# EAGLE design Reach_A0 (EAGLE 6.5.0)
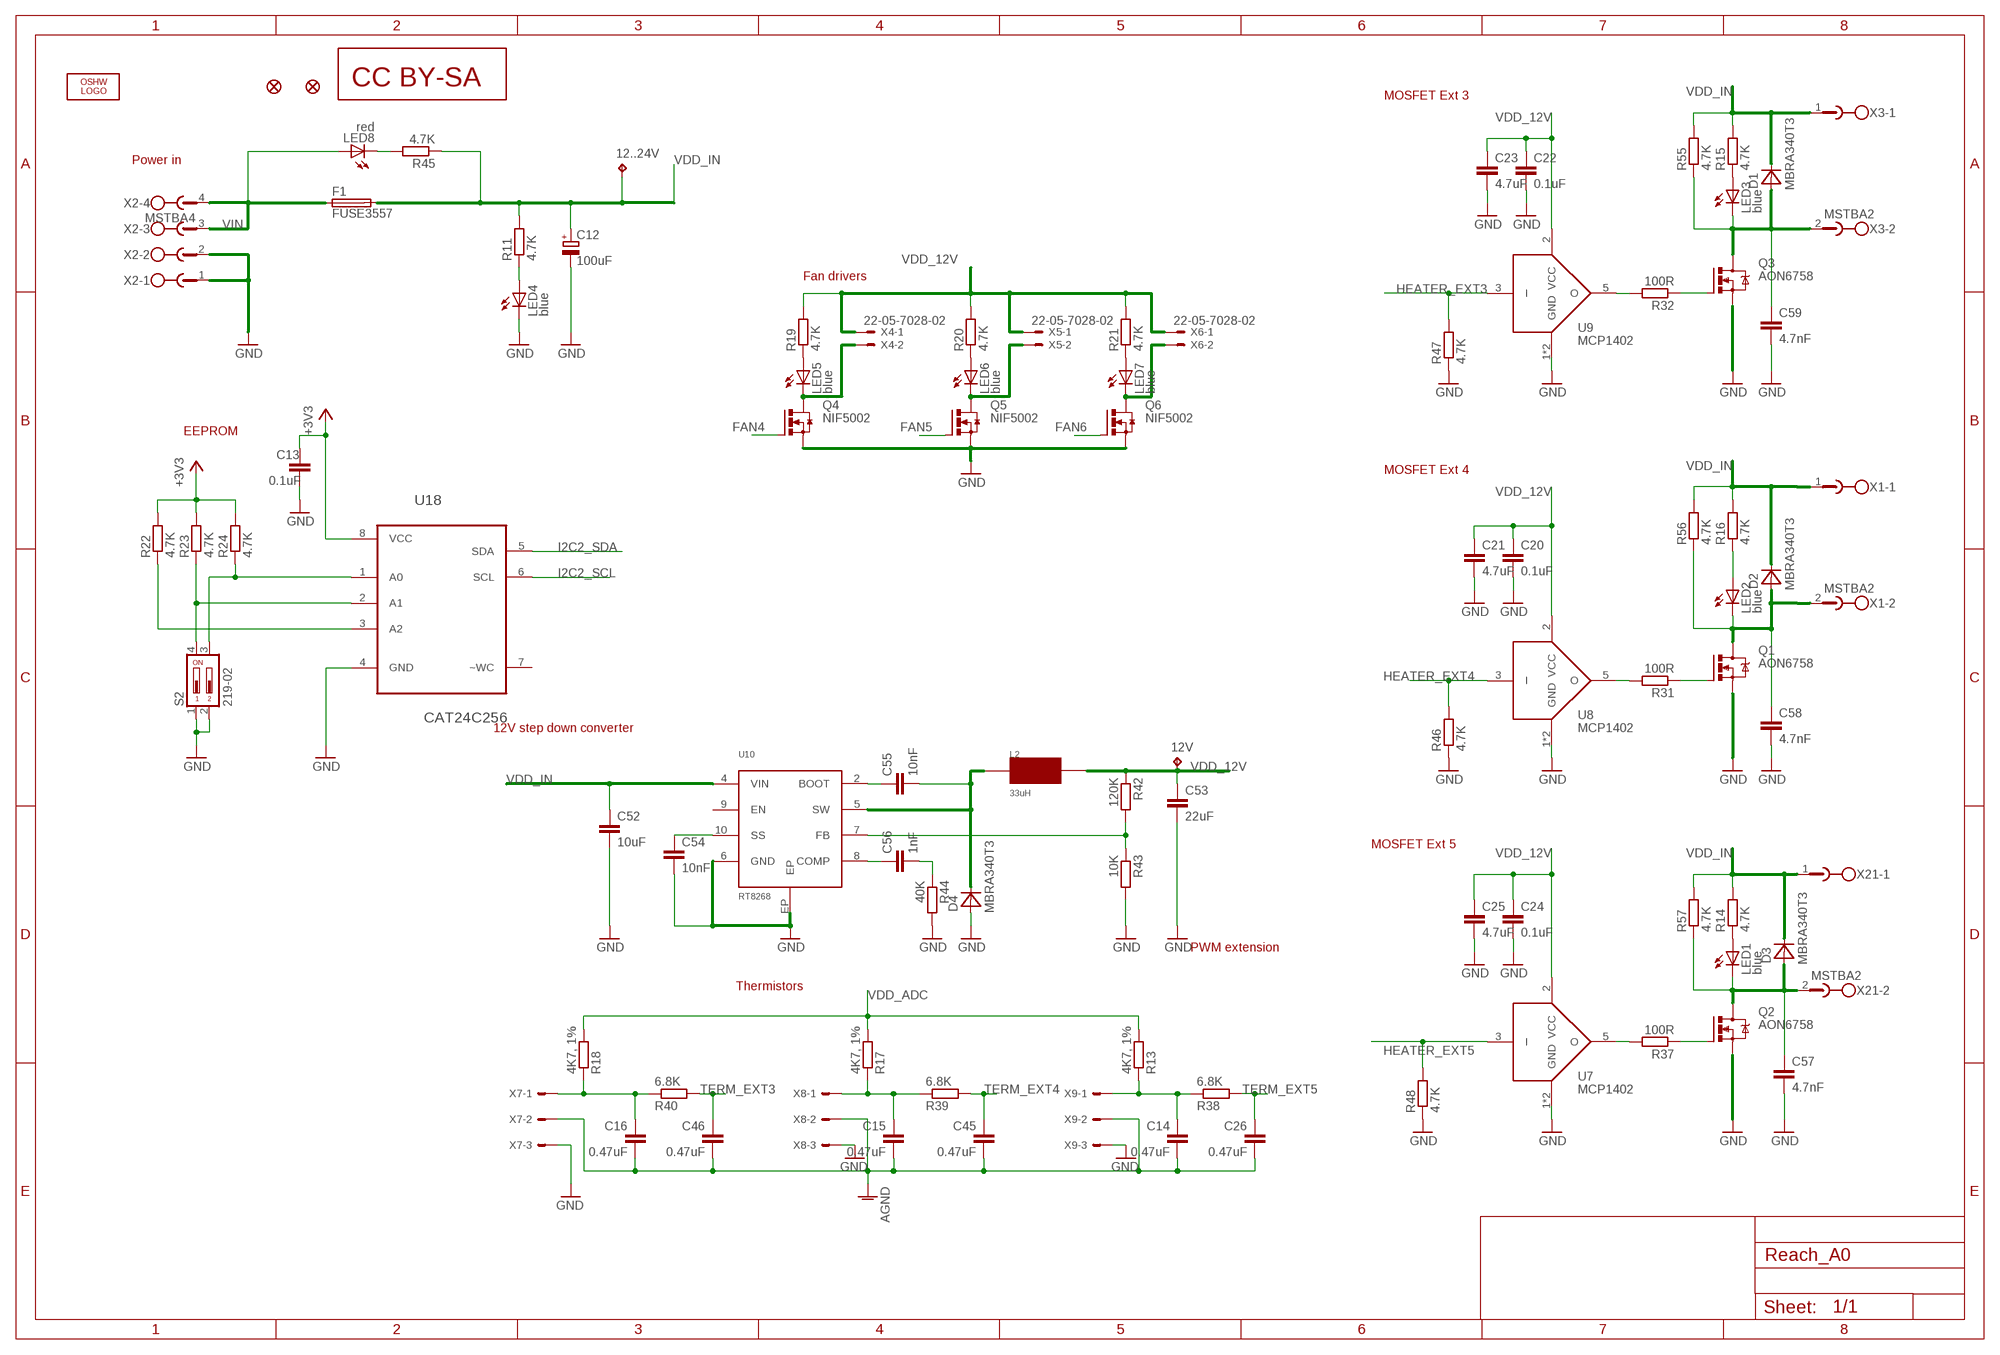
[diagram p0: schematic, sheet 1, part 1 of 2]
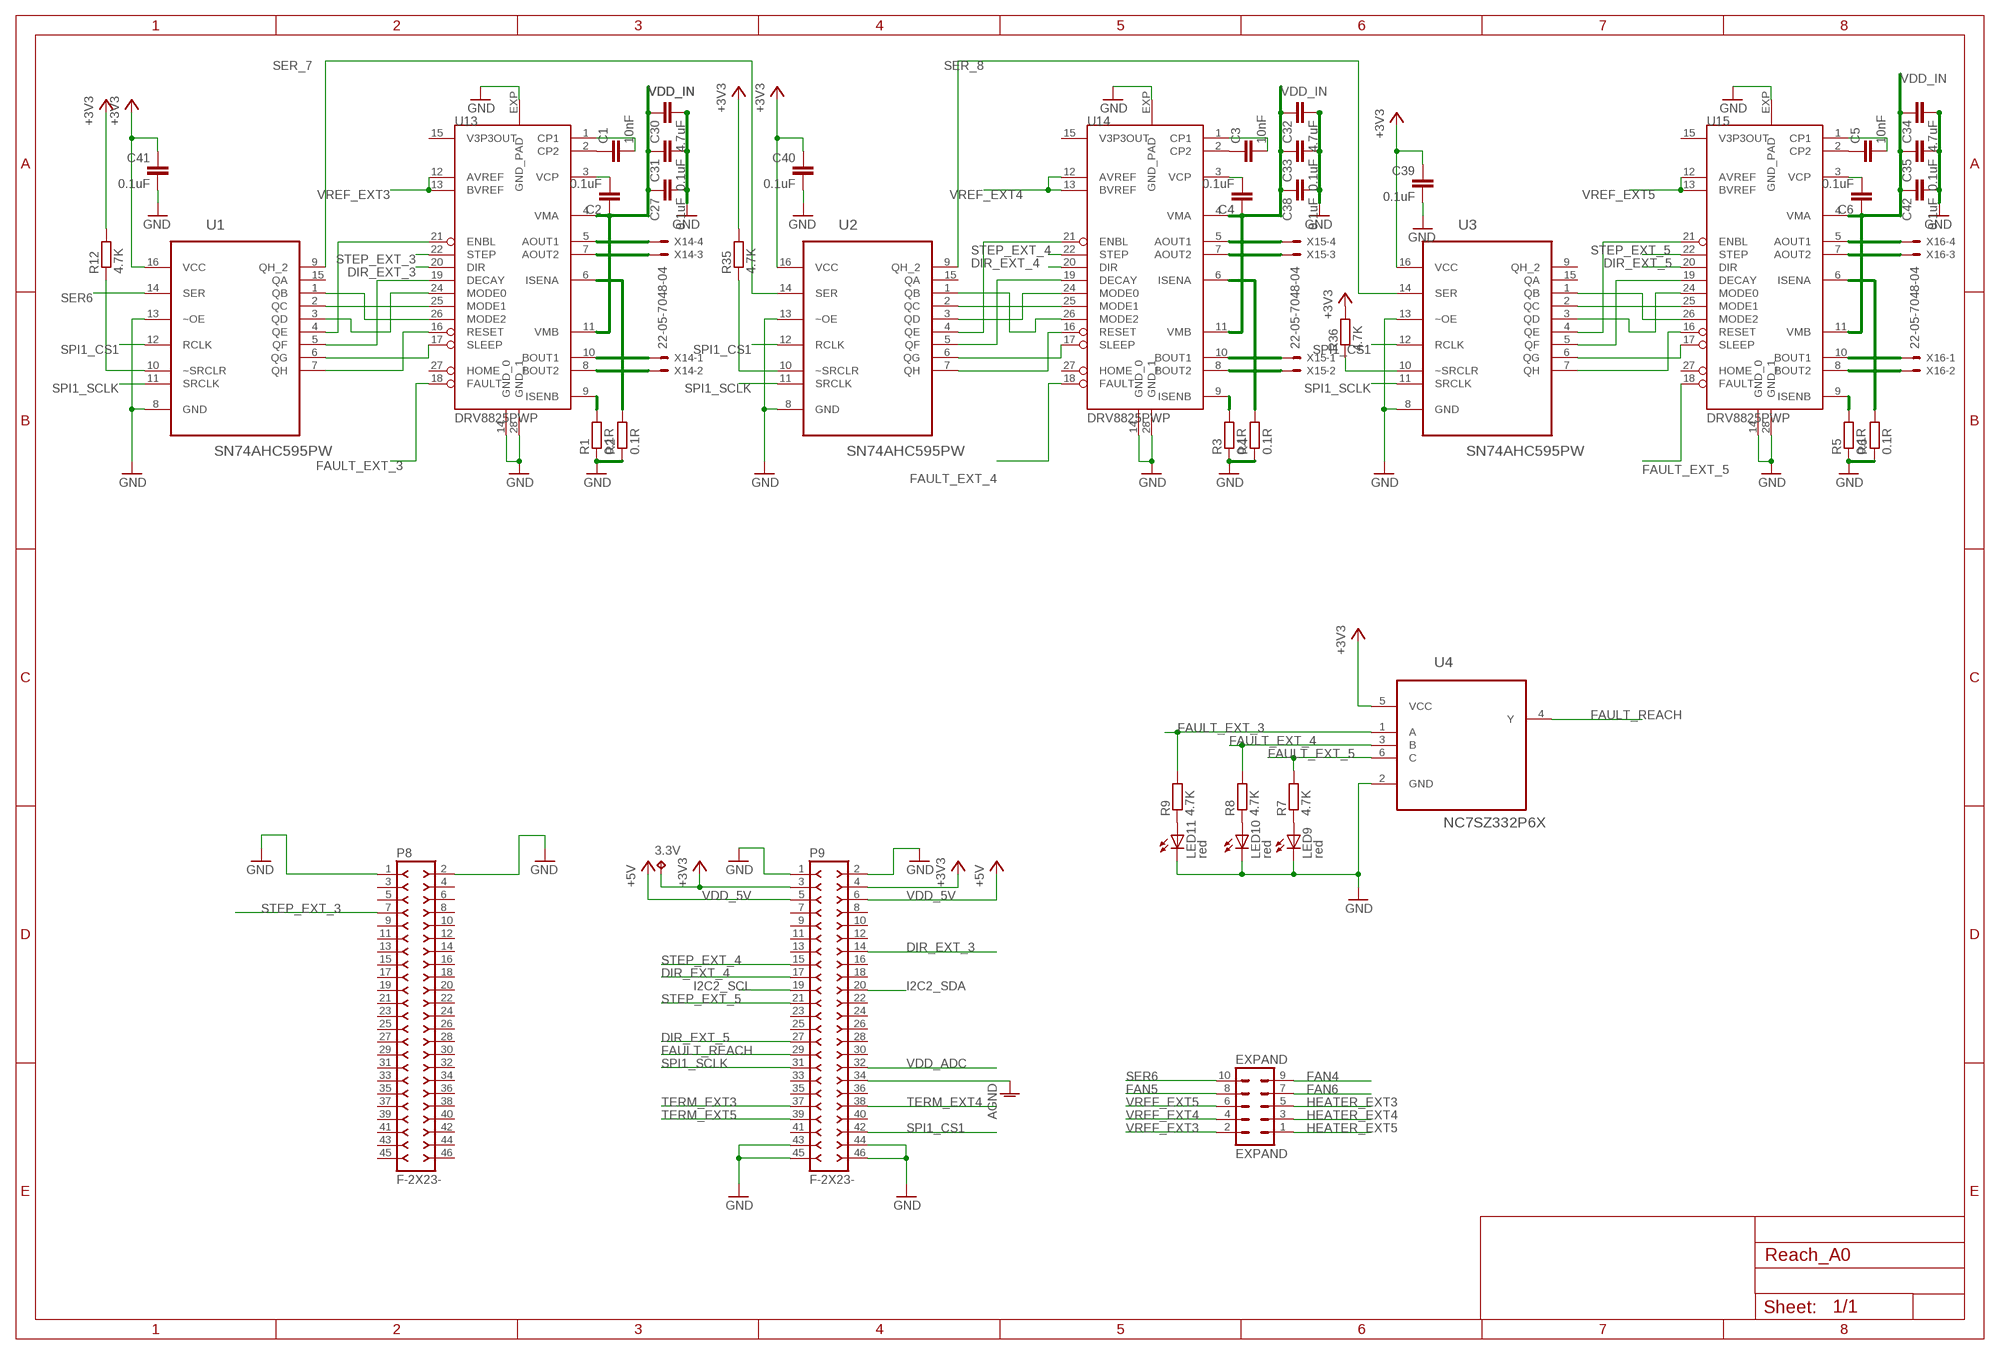
[diagram p1: schematic, sheet 1, part 2 of 2]

## Parts
3.3V  TPB1,27  [B1,27]
12..24V  TPB1,27  [B1,27]
12V  TPB1,27  [B1,27]
C1  10nF  C-EUC0402  [C0402]
C2  0.1uF  C-EUC0402  [C0402]
C3  10nF  C-EUC0402  [C0402]
C4  0.1uF  C-EUC0402  [C0402]
C5  10nF  C-EUC0402  [C0402]
C6  0.1uF  C-EUC0402  [C0402]
C12  100uF  CPOL-EU140CLH-0810  [140CLH-0810]
C13  0.1uF  C-EUC0402  [C0402]
C14  0.47uF  C-EUC0402  [C0402]
C15  0.47uF  C-EUC0402  [C0402]
C16  0.47uF  C-EUC0402  [C0402]
C20  0.1uF  C-EUC0402  [C0402]
C21  4.7uF  C-EUC0402  [C0402]
C22  0.1uF  C-EUC0402  [C0402]
C23  4.7uF  C-EUC0402  [C0402]
C24  0.1uF  C-EUC0402  [C0402]
C25  4.7uF  C-EUC0402  [C0402]
C26  0.47uF  C-EUC0402  [C0402]
C27  0.1uF  C-EUC0402  [C0402]
C30  4.7uF  C-EUC0603  [C0603]
C31  0.1uF  C-EUC0402  [C0402]
C32  4.7uF  C-EUC0603  [C0603]
C33  0.1uF  C-EUC0402  [C0402]
C34  4.7uF  C-EUC0603  [C0603]
C35  0.1uF  C-EUC0402  [C0402]
C38  0.1uF  C-EUC0402  [C0402]
C39  0.1uF  C-EUC0402  [C0402]
C40  0.1uF  C-EUC0402  [C0402]
C41  0.1uF  C-EUC0402  [C0402]
C42  0.1uF  C-EUC0402  [C0402]
C45  0.47uF  C-EUC0402  [C0402]
C46  0.47uF  C-EUC0402  [C0402]
C52  10uF  C-EUC1206  [C1206]
C53  22uF  C-EUC0805  [C0805]
C54  10nF  C-EUC0402  [C0402]
C55  10nF  C-EUC0402  [C0402]
C56  1nF  C-EUC0402  [C0402]
C57  4.7nF  C-EUC0402  [C0402]
C58  4.7nF  C-EUC0402  [C0402]
C59  4.7nF  C-EUC0402  [C0402]
D1  MBRA340T3  [SMA]
D2  MBRA340T3  [SMA]
D3  MBRA340T3  [SMA]
D4  MBRA340T3  [SMA]
EXPAND  EXPAND  MA05-2  [MA05-2]
F1  FUSE3557  [3557]
JP1  FIDUCIAL1X2.5  [FIDUCIAL-1X2.5]
JP2  FIDUCIAL1X2.5  [FIDUCIAL-1X2.5]
L2  33uH  RT8040T330  [NR8040T330]
LED1  blue  LEDCHIP-LED0603  [CHIP-LED0603]
LED2  blue  LEDCHIP-LED0603  [CHIP-LED0603]
LED3  blue  LEDCHIP-LED0603  [CHIP-LED0603]
LED4  blue  LEDCHIP-LED0603  [CHIP-LED0603]
LED5  blue  LEDCHIP-LED0603  [CHIP-LED0603]
LED6  blue  LEDCHIP-LED0603  [CHIP-LED0603]
LED7  blue  LEDCHIP-LED0603  [CHIP-LED0603]
LED8  red  LEDCHIP-LED0603  [CHIP-LED0603]
LED9  red  LEDCHIP-LED0603  [CHIP-LED0603]
LED10  red  LEDCHIP-LED0603  [CHIP-LED0603]
LED11  red  LEDCHIP-LED0603  [CHIP-LED0603]
LOGO1  OSHW_LOGO_FILLX0200-NT  [OSHW_FILLX200_NOTEXT]
P8  F-2X23-  [DIL-100-2X23]
P9  F-2X23-  [DIL-100-2X23]
Q1  AON6758  [8-DFN-EP-(5X6)]
Q2  AON6758  [8-DFN-EP-(5X6)]
Q3  AON6758  [8-DFN-EP-(5X6)]
Q4  NIF5002  N-HEXFET-2D_SOT232-  [SOT223]
Q5  NIF5002  N-HEXFET-2D_SOT232-  [SOT223]
Q6  NIF5002  N-HEXFET-2D_SOT232-  [SOT223]
R1  0.1R  R-EU_R0805  [R0805]
R2  0.1R  R-EU_R0805  [R0805]
R3  0.1R  R-EU_R0805  [R0805]
R4  0.1R  R-EU_R0805  [R0805]
R5  0.1R  R-EU_R0805  [R0805]
R6  0.1R  R-EU_R0805  [R0805]
R7  4.7K  R-EU_R0402  [R0402]
R8  4.7K  R-EU_R0402  [R0402]
R9  4.7K  R-EU_R0402  [R0402]
R11  4.7K  R-EU_R0402  [R0402]
R12  4.7K  R-EU_R0402  [R0402]
R13  4K7, 1%  R-EU_R0402  [R0402]
R14  4.7K  R-EU_R0402  [R0402]
R15  4.7K  R-EU_R0402  [R0402]
R16  4.7K  R-EU_R0402  [R0402]
R17  4K7, 1%  R-EU_R0402  [R0402]
R18  4K7, 1%  R-EU_R0402  [R0402]
R19  4.7K  R-EU_R0402  [R0402]
R20  4.7K  R-EU_R0402  [R0402]
R21  4.7K  R-EU_R0402  [R0402]
R22  4.7K  R-EU_R0402  [R0402]
R23  4.7K  R-EU_R0402  [R0402]
R24  4.7K  R-EU_R0402  [R0402]
R31  100R  R-EU_R0402  [R0402]
R32  100R  R-EU_R0402  [R0402]
R35  4.7K  R-EU_R0402  [R0402]
R36  4.7K  R-EU_R0402  [R0402]
R37  100R  R-EU_R0402  [R0402]
R38  6.8K  R-EU_R0402  [R0402]
R39  6.8K  R-EU_R0402  [R0402]
R40  6.8K  R-EU_R0402  [R0402]
R42  120K  R-EU_R0402  [R0402]
R43  10K  R-EU_R0402  [R0402]
R44  40K  R-EU_R0402  [R0402]
R45  4.7K  R-EU_R0402  [R0402]
R46  4.7K  R-EU_R0402  [R0402]
R47  4.7K  R-EU_R0402  [R0402]
R48  4.7K  R-EU_R0402  [R0402]
R55  4.7K  R-EU_R0402  [R0402]
R56  4.7K  R-EU_R0402  [R0402]
R57  4.7K  R-EU_R0402  [R0402]
S2  219-02  [CTS-219-02]
U1  SN74AHC595PW  [SOP65P640X120-16N]
U2  SN74AHC595PW  [SOP65P640X120-16N]
U3  SN74AHC595PW  [SOP65P640X120-16N]
U4  NC7SZ332P6X  [SOT65P210X110-6N]
U7  MCP1402  [SOT23-5L]
U8  MCP1402  [SOT23-5L]
U9  MCP1402  [SOT23-5L]
U10  RT8268  [MSOP10]
U13  DRV8825PWP  [TSSOP-28]
U14  DRV8825PWP  [TSSOP-28]
U15  DRV8825PWP  [TSSOP-28]
U18  CAT24C256  [SOIC127P600X175-8N]
U$3  CC-BY-SA  [CC-BY-SA]
X1  MSTBA2  [MSTBA2]
X2  MSTBA4  [MSTBA4]
X3  MSTBA2  [MSTBA2]
X4  22-05-7028-02  [7395-02]
X5  22-05-7028-02  [7395-02]
X6  22-05-7028-02  [7395-02]
X7  22-05-7038-03  [7395-03]
X8  22-05-7038-03  [7395-03]
X9  22-05-7038-03  [7395-03]
X14  22-05-7048-04  [7395-04]
X15  22-05-7048-04  [7395-04]
X16  22-05-7048-04  [7395-04]
X21  MSTBA2  [MSTBA2]

## Nets
+3V3: 3.3V.TP C13.1 C39.1 C40.1 C41.1 P9.3 P9.4 R12.2 R22.2 R23.2 R24.2 R35.2 R36.2 U1.16(VCC) U2.16(VCC) U3.16(VCC) U4.5(VCC) U18.8(VCC)
A1_X: U13.5(AOUT1) X14.4
A2_X: U13.7(AOUT2) X14.3
AGND: C14.2 C15.2 C16.2 C26.2 C45.2 C46.2 P9.34 X7.2 X8.2 X9.2
B1_X: U13.10(BOUT1) X14.1
DIR_EXT_3: P9.14 U13.20(DIR)
DIR_EXT_4: P9.17 U14.20(DIR)
DIR_EXT_5: P9.27 U15.20(DIR)
FAN4: EXPAND.9 Q4.1(G)
FAN5: EXPAND.8 Q5.1(G)
FAN6: EXPAND.7 Q6.1(G)
FAULT_EXT_3: R9.2 U4.1(A) U13.18(FAULT)
FAULT_EXT_4: R8.2 U4.3(B) U14.18(FAULT)
FAULT_EXT_5: R7.2 U4.6(C) U15.18(FAULT)
FAULT_REACH: P9.29 U4.4(Y)
GND: C12.- C13.2 C20.2 C21.2 C22.2 C23.2 C24.2 C25.2 C27.2 C30.2 C31.2 C32.2 C33.2 C34.2 C35.2 C38.2 C39.2 C40.2 C41.2 C42.2 C52.2 C53.2 C54.2 C57.2 C58.2 C59.2 D4.A LED4.C LED9.C LED10.C LED11.C P8.1 P8.2 P9.1 P9.2 P9.43 P9.44 P9.45 P9.46 Q1.1(S) Q1.2(S) Q1.3(S) Q2.1(S) Q2.2(S) Q2.3(S) Q3.1(S) Q3.2(S) Q3.3(S) Q4.3(S) Q5.3(S) Q6.3(S) R1.1 R2.1 R3.1 R4.1 R5.1 R6.1 R43.2 R44.2 R46.1 R47.1 R48.1 S2.1 S2.2 U1.8(GND) U1.13(~OE) U2.8(GND) U2.13(~OE) U3.8(GND) U3.13(~OE) U4.2(GND) U7.1(GND) U7.4(GND) U8.1(GND) U8.4(GND) U9.1(GND) U9.4(GND) U10.6(GND) U10.EP U13.14(GND_0) U13.28(GND_1) U13.EXP(GND_PAD) U14.14(GND_0) U14.28(GND_1) U14.EXP(GND_PAD) U15.14(GND_0) U15.28(GND_1) U15.EXP(GND_PAD) U18.4(GND) X2.1 X2.2 X7.3 X8.3 X9.3
HEATER_EXT3: EXPAND.5 R47.2 U9.3(I)
HEATER_EXT4: EXPAND.3 R46.2 U8.3(I)
HEATER_EXT5: EXPAND.1 R48.2 U7.3(I)
I2C2_SCL: P9.19 U18.6(SCL)
I2C2_SDA: P9.20 U18.5(SDA)
N$2: U13.8(BOUT2) X14.2
N$3: U14.8(BOUT2) X15.2
N$4: U15.10(BOUT1) X16.1
N$5: U15.8(BOUT2) X16.2
N$6: LED9.A R7.1
N$8: LED8.C R45.2
N$9: LED5.A R19.1
N$11: LED10.A R8.1
N$13: LED11.A R9.1
N$16: C1.1 U13.2(CP2)
N$17: C1.2 U13.1(CP1)
N$18: R1.2 U13.9(ISENB)
N$19: R2.2 U13.6(ISENA)
N$21: R32.2 U9.5(O)
N$22: C2.2 U13.3(VCP)
N$23: Q2.4(G) R37.1
N$34: C3.1 U14.2(CP2)
N$35: C3.2 U14.1(CP1)
N$36: R3.2 U14.9(ISENB)
N$37: R4.2 U14.6(ISENA)
N$38: C4.2 U14.3(VCP)
N$41: R37.2 U7.5(O)
N$52: C5.1 U15.2(CP2)
N$53: C5.2 U15.1(CP1)
N$54: R5.2 U15.9(ISENB)
N$55: R6.2 U15.6(ISENA)
N$56: C6.2 U15.3(VCP)
N$60: Q1.4(G) R31.1
N$61: R31.2 U8.5(O)
N$64: C57.1 D3.A LED1.C Q2.5(D) Q2.6(D) Q2.7(D) Q2.8(D) Q2.TH(D) R57.1 X21.2
N$96: LED4.A R11.1
N$97: R12.1 U1.10(~SRCLR)
N$100: R35.1 U2.10(~SRCLR)
N$101: R36.1 U3.10(~SRCLR)
N$114: LED7.C Q6.2(D) Q6.4(D) X6.2
N$115: LED6.C Q5.2(D) Q5.4(D) X5.2
N$116: LED5.C Q4.2(D) Q4.4(D) X4.2
N$117: LED6.A R20.1
N$118: LED7.A R21.1
N$127: LED3.A R15.1
N$129: LED1.A R14.1
N$130: LED2.A R16.1
N$133: Q3.4(G) R32.1
N$147: R24.1 S2.3 U18.1(A0)
N$148: R23.1 S2.4 U18.2(A1)
N$149: R22.1 U18.3(A2)
N$233: R42.2 R43.1 U10.7(FB)
N$234: C59.1 D1.A LED3.C Q3.5(D) Q3.6(D) Q3.7(D) Q3.8(D) Q3.TH(D) R55.1 X3.2
N$237: C14.1 R13.1 R38.1 X9.1
N$238: C55.2 D4.C L2.P$2 U10.5(SW)
N$240: C16.1 R18.1 R40.1 X7.1
N$241: C15.1 R17.1 R39.1 X8.1
N$242: C58.1 D2.A LED2.C Q1.5(D) Q1.6(D) Q1.7(D) Q1.8(D) Q1.TH(D) R56.1 X1.2
N$243: C54.1 U10.10(SS)
N$244: C56.1 U10.8(COMP)
N$245: C55.1 U10.2(BOOT)
N$246: C56.2 R44.1
SER6: EXPAND.10 U1.14(SER)
SER_7: U1.9(QH_2) U2.14(SER)
SER_8: U2.9(QH_2) U3.14(SER)
SPI1_CS1: P9.42 U1.12(RCLK) U2.12(RCLK) U3.12(RCLK)
SPI1_SCLK: P9.31 U1.11(SRCLK) U2.11(SRCLK) U3.11(SRCLK)
STEP1_Y: U14.5(AOUT1) X15.4
STEP1_Z: U15.5(AOUT1) X16.4
STEP2_Y: U14.7(AOUT2) X15.3
STEP2_Z: U15.7(AOUT2) X16.3
STEP3_Y: U14.10(BOUT1) X15.1
STEP_EXT_3: P8.7 U13.22(STEP)
STEP_EXT_4: P9.15 U14.22(STEP)
STEP_EXT_5: P9.21 U15.22(STEP)
TERM_EXT3: C46.1 P9.37 R40.2
TERM_EXT4: C45.1 P9.38 R39.2
TERM_EXT5: C26.1 P9.39 R38.2
VDD_5V: P9.5 P9.6 ; supply symbol labelled +5V
VDD_12V: 12V.TP C20.1 C21.1 C22.1 C23.1 C24.1 C25.1 C53.1 L2.P$1 R19.2 R20.2 R21.2 R42.1 U7.2(VCC) U8.2(VCC) U9.2(VCC) X4.1 X5.1 X6.1
VDD_ADC: P9.32 R13.2 R17.2 R18.2
VDD_IN: 12..24V.TP C2.1 C4.1 C6.1 C12.+ C27.1 C30.1 C31.1 C32.1 C33.1 C34.1 C35.1 C38.1 C42.1 C52.1 D1.C D2.C D3.C F1.3 F1.4 R11.2 R14.2 R15.2 R16.2 R45.1 R55.2 R56.2 R57.2 U10.4(VIN) U13.4(VMA) U13.11(VMB) U14.4(VMA) U14.11(VMB) U15.4(VMA) U15.11(VMB) X1.1 X3.1 X21.1
VIN: F1.1 F1.2 LED8.A X2.3 X2.4
VREF_EXT3: EXPAND.2 U13.12(AVREF) U13.13(BVREF)
VREF_EXT4: EXPAND.4 U14.12(AVREF) U14.13(BVREF)
VREF_EXT5: EXPAND.6 U15.12(AVREF) U15.13(BVREF)
X_DECAY: U1.5(QF) U13.19(DECAY)
X_MODE0: U1.3(QD) U13.24(MODE0)
X_MODE1: U1.2(QC) U13.25(MODE1)
X_MODE2: U1.1(QB) U13.26(MODE2)
X_NENABLE: U1.4(QE) U13.21(ENBL)
X_NRESET: U1.7(QH) U13.16(RESET)
X_NSLEEP: U1.6(QG) U13.17(SLEEP)
Y_DECAY: U2.5(QF) U14.19(DECAY)
Y_MODE0: U2.3(QD) U14.24(MODE0)
Y_MODE1: U2.2(QC) U14.25(MODE1)
Y_MODE2: U2.1(QB) U14.26(MODE2)
Y_NENABLE: U2.4(QE) U14.21(ENBL)
Y_NRESET: U2.7(QH) U14.16(RESET)
Y_NSLEEP: U2.6(QG) U14.17(SLEEP)
Z_DECAY: U3.5(QF) U15.19(DECAY)
Z_MODE0: U3.3(QD) U15.24(MODE0)
Z_MODE1: U3.2(QC) U15.25(MODE1)
Z_MODE2: U3.1(QB) U15.26(MODE2)
Z_NENABLE: U3.4(QE) U15.21(ENBL)
Z_NRESET: U3.7(QH) U15.16(RESET)
Z_NSLEEP: U3.6(QG) U15.17(SLEEP)
Unconnected: P8.3 P8.4 P8.5 P8.6 P8.8 P8.9 P8.10 P8.11 P8.12 P8.13 P8.14 P8.15 P8.16 P8.17 P8.18 P8.19 P8.20 P8.21 P8.22 P8.23 P8.24 P8.25 P8.26 P8.27 P8.28 P8.29 P8.30 P8.31 P8.32 P8.33 P8.34 P8.35 P8.36 P8.37 P8.38 P8.39 P8.40 P8.41 P8.42 P8.43 P8.44 P8.45 P8.46 P9.7 P9.8 P9.9 P9.10 P9.11 P9.12 P9.13 P9.16 P9.18 P9.22 P9.23 P9.24 P9.25 P9.26 P9.28 P9.30 P9.33 P9.35 P9.36 P9.40 P9.41 U1.15(QA) U2.15(QA) U3.9(QH_2) U3.15(QA) U10.9(EN) U13.15(V3P3OUT) U13.27(HOME) U14.15(V3P3OUT) U14.27(HOME) U15.15(V3P3OUT) U15.27(HOME) U18.7(~WC)

## Notes on the sheet
- MOSFET Ext 3
- Power in
- Fan drivers
- EEPROM
- MOSFET Ext 4
- 12V step down converter
- MOSFET Ext 5
- PWM extension
- Thermistors

## Library data of the parts
3.3V 12..24V 12V = testpad:TP: Test pad
C1-C6 C13-C16 C20-C27 C30-C35 C38-C42 C45 C46 C52-C59 = rcl:C-EU: CAPACITOR, European symbol
C12 = rcl:CPOL-EU: POLARIZED CAPACITOR, European symbol
D1-D4 = diode:MBRA340T3: Surface Mount Schottky Power Rectifier Source: http://www.onsemi.com/pub_link/Collateral/MBRA340T3-D.PDF
EXPAND = con-lstb:MA05-2: PIN HEADER; OC_FARNELL: unknown; OC_NEWARK: unknown
F1 = fuse:FUSE: Fuse
JP1 JP2 = SparkFun:FIDUCIAL: Fiducial Alignment Points Various fiducial points for machine vision alignment.
L2 = SparkFun:RT8040T330
LED1-LED11 = led:LED: LED OSRAM: - CHIPLED LG R971, LG N971, LY N971, LG Q971, LY Q971, LO R971, LY R971 LH N974, LH R974 LS Q976, LO Q976, LY Q976 LO Q996 - Hyper CHIPLED LW Q18S LB Q993, LB Q99A, LB R99A - SideLED LS A670, LO A670, LY A670, LG A670, LP A670 LB A673, LV A673, LT A673, LW A673 LH A674 LY A675 LS A676, LA A676, LO A676, LY A676, LW A676 LS A679, LY A679, LG A679 - Hyper Micro SIDELED® LS Y876, LA Y876, LO Y876, LY Y876 LT Y87S - SmartLED LW L88C, LW L88S LB L89C, LB L89S, LG L890 LS L89K, LO L89K, LY L89K LS L896, LA L896, LO L896, LY L896 - TOPLED LS T670, LO T670, LY T670, LG T670, LP T670 LSG T670, LSP T670, LSY T670, LOP T670, LYG T670 LG T671, LOG T671, LSG T671 LB T673, LV T673, LT T673, LW T673 LH T674 LS T676, LA T676, LO T676, LY T676, LB T676, LH T676, LSB T676, LW T676 LB T67C, LV T67C, LT T67C, LS T67K, LO T67K, LY T67K, LW E67C LS E67B, LA E67B, LO E67B, LY E67B, LB E67C, LV E67C, LT E67C LW T67C LS T679, LY T679, LG T679 LS T770, LO T770, LY T770, LG T770, LP T770 LB T773, LV T773, LT T773, LW T773 LH T774 LS E675, LA E675, LY E675, LS T675 LS T776, LA T776, LO T776, LY T776, LB T776 LHGB T686 LT T68C, LB T68C - Hyper Mini TOPLED® LB M676 - Mini TOPLED Santana® LG M470 LS M47K, LO M47K, LY M47K Source: http://www.osram.convergy.de LUXEON: - LUMILED® LXK2-PW12-R00, LXK2-PW12-S00, LXK2-PW14-U00, LXK2-PW14-V00 LXK2-PM12-R00, LXK2-PM12-S00, LXK2-PM14-U00 LXK2-PE12-Q00, LXK2-PE12-R00, LXK2-PE12-S00, LXK2-PE14-T00, LXK2-PE14-U00 LXK2-PB12-K00, LXK2-PB12-L00, LXK2-PB12-M00, LXK2-PB14-N00, LXK2-PB14-P00, LXK2-PB14-Q00 LXK2-PR12-L00, LXK2-PR12-M00, LXK2-PR14-Q00, LXK2-PR14-R00 LXK2-PD12-Q00, LXK2-PD12-R00, LXK2-PD12-S00 LXK2-PH12-R00, LXK2-PH12-S00 LXK2-PL12-P00, LXK2-PL12-Q00, LXK2-PL12-R00 Source: www.luxeon.com KINGBRIGHT: KA-3528ASYC Source: www.kingbright.com
LOGO1 = ohw-logo:OSHW_LOGO_FILL
P8 P9 = con-headers-jp:F-2X23-
Q1-Q3 = transistor-power:AON6758
Q4-Q6 = transistor-power:N-HEXFET-2D_?-*: HEXFET® Power MOSFET 2 Drain connects http://www.irf.com/product-info/datasheets/data/irll014n.pdf
R1-R9 R11-R24 R31 R32 R35-R40 R42-R48 R55-R57 = rcl:R-EU_: RESISTOR, European symbol
S2 = switch-dil:219-02*: Surface Mount DIP Switch Series 219 SMT CTS Electronic Components Sourc: www.ctscorp.com; OC_FARNELL: unknown; OC_NEWARK: unknown
U1-U3 = sn74hc595:SN74AHC595PW: 8 bit shift registers with 3-state output registers; MPN: SN74AHC595PW; OC_FARNELL: 1741463; OC_NEWARK: 50R5930; PACKAGE: TSSOP-16; SUPPLIER: Texas Instruments
U4 = SN74LVC1G332DCKR:NC7SZ332P6X: UHS 3-Input OR Gate; MPN: NC7SZ332P6X; OC_FARNELL: 1607793; OC_NEWARK: 58K1984; PACKAGE: SC-70-6; SUPPLIER: FAIRCHILD SEMICONDUCTOR
U7-U9 = microchip-6:MCP1402: MOSFET driver
U10 = SparkFun:RT8268
U13-U15 = drv88xx:DRV8825PWP
U18 = custom:CAT24C256
U$3 = cc-by-sa:CC-BY-SA
X1 X3 X21 = con-phoenix-508:MSTBA2: PHOENIX
X2 = con-phoenix-508:MSTBA4: PHOENIX
X4-X6 = con-molex:22-?-02: CONNECTOR wire to board 2.54 mm (.1 inch) pitch header; OC_FARNELL: 9731601; OC_NEWARK: unknown
X7-X9 = con-molex:22-?-03: CONNECTOR wire to board 2.54 mm (.1 inch) pitch header; OC_FARNELL: unknown; OC_NEWARK: unknown
X14-X16 = con-molex:22-?-04: CONNECTOR wire to board 2.54 mm (.1 inch) pitch header; OC_FARNELL: unknown; OC_NEWARK: unknown

## Net classes
1 power: width 1.27 mm

## Board
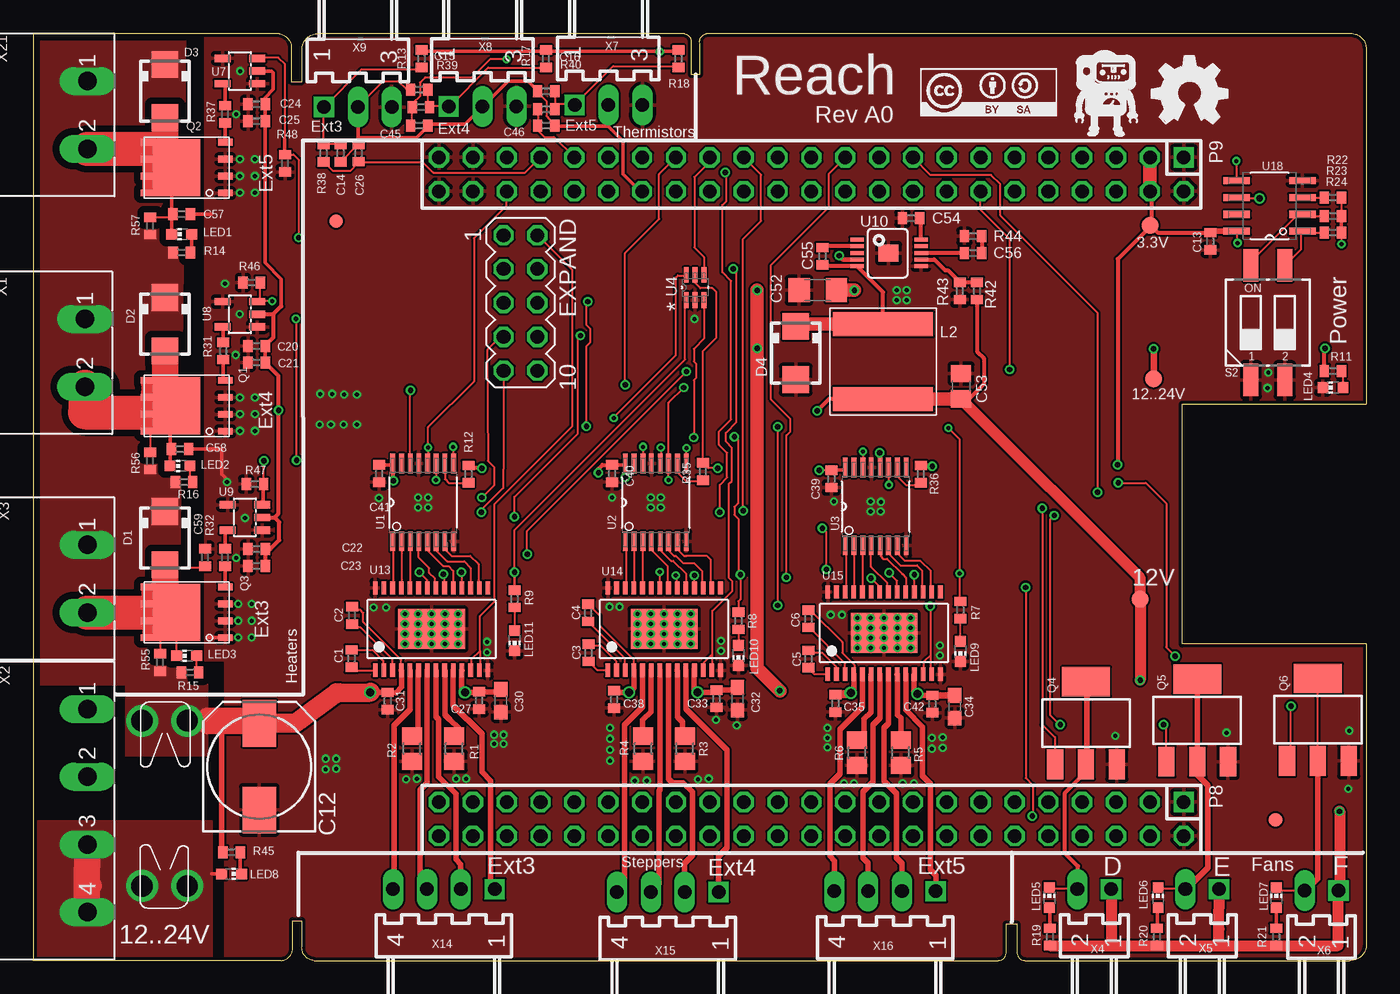
[diagram p2: board, top side]
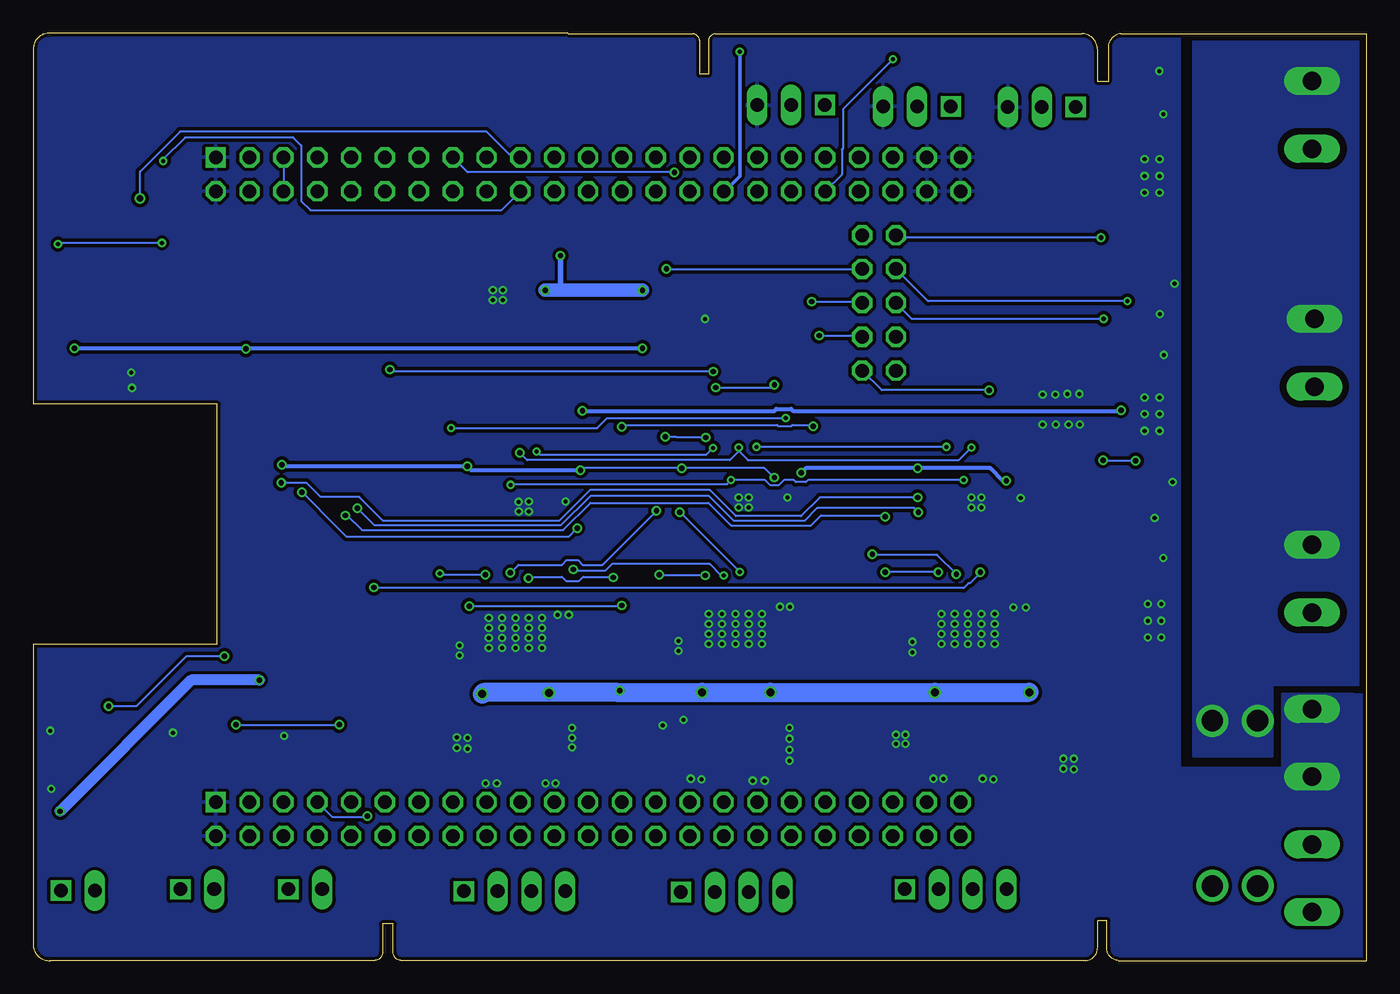
[diagram p3: board, bottom side, seen from below]

Size 100 x 69.58 mm. Coordinates in mm from the lower left corner, seen from the top.
Outline: 59.88,69.55 50.5,69.55 arc90 50,68.85 50,66.5 49.35,66.5 49.35,68.85 arc90 48.85,69.55 21.35,69.55 arc90 20.15,68.35 20.15,65.95 19.35,65.95 19.35,68.35 arc90 18.43,69.55 0,69.55 0,0 18.6,0 arc90 19.45,0.95 19.45,3 20.15,3 20.15,1.05 arc90 21.05,0 72.4,0 arc90 73,0.65 73,2.75 73.8,2.75 73.8,0.65 arc90 74.4,0 98.75,0 arc90 100,1.1 100,23.75 86.19,23.75 86.19,41.75 100,41.75 100,68.5 arc90 98.75,69.58 59.88,69.58
Copper layers (1*16): Top 0.035mm / dielectric 1.5mm / Bottom 0.035mm
Design rules "default": minimum track width 6mil, minimum drill 12mil, track to track 6mil, track to pad 6mil, pad to pad 6mil, via to via 6mil, smd to smd 0mil, copper to edge 10mil, drill to drill 10mil, minimum pad ring 10mil, minimum via ring 6mil, stop-mask expansion 2mil, vias tented up to drill 100mil, thermal gap 10mil

### Footprints (pad centres in the part's own frame; a part is rotated, then mirrored left to right if it is on the bottom)
B1,27 = smd 1.27 x 1.27: TP 0,0
C0402 = smd 0.7 x 0.9: 1 -0.65,0; 2 0.65,0
140CLH-0810 = smd 3.5 x 2.5: + 3.25,0; - -3.25,0
C0603 = smd 1.1 x 1: 1 -0.85,0; 2 0.85,0
C1206 = smd 1.6 x 1.8: 1 -1.4,0; 2 1.4,0
C0805 = smd 1.3 x 1.5: 1 -0.95,0; 2 0.95,0
SMA = smd 2 x 2: A 2,0; C -2,0
MA05-2 = drill 1.016 octagon: 1 -5.08,-1.27; 2 -5.08,1.27; 3 -2.54,-1.27; 4 -2.54,1.27; 5 0,-1.27; 6 0,1.27; 7 2.54,-1.27; 8 2.54,1.27; 9 5.08,-1.27; 10 5.08,1.27
3557 = drill 1.6: 1 -6.2,1.7; 2 -6.2,-1.7; 3 6.2,-1.7; 4 6.2,1.7
FIDUCIAL-1X2.5 = smd 1 x 1: 1 0,0
NR8040T330 = smd 1.8 x 7.5: P$1 2.8,0; P$2 -2.8,0
CHIP-LED0603 = smd 0.8 x 0.8: A 0,-0.75; C 0,0.75
DIL-100-2X23 = drill 1.016 square: 1 -27.94,-1.27 | drill 1.016 octagon: 2 -27.94,1.27; 3 -25.4,-1.27; 4 -25.4,1.27; 5 -22.86,-1.27; 6 -22.86,1.27; 7 -20.32,-1.27; 8 -20.32,1.27; 9 -17.78,-1.27; 10 -17.78,1.27; 11 -15.24,-1.27; 12 -15.24,1.27; 13 -12.7,-1.27; 14 -12.7,1.27; 15 -10.16,-1.27; 16 -10.16,1.27; 17 -7.62,-1.27; 18 -7.62,1.27; 19 -5.08,-1.27; 20 -5.08,1.27; 21 -2.54,-1.27; 22 -2.54,1.27; 23 0,-1.27; 24 0,1.27; 25 2.54,-1.27; 26 2.54,1.27; 27 5.08,-1.27; 28 5.08,1.27; 29 7.62,-1.27; 30 7.62,1.27; 31 10.16,-1.27; 32 10.16,1.27; 33 12.7,-1.27; 34 12.7,1.27; 35 15.24,-1.27; 36 15.24,1.27; 37 17.78,-1.27; 38 17.78,1.27; 39 20.32,-1.27; 40 20.32,1.27; 41 22.86,-1.27; 42 22.86,1.27; 43 25.4,-1.27; 44 25.4,1.27; 45 27.94,-1.27; 46 27.94,1.27
8-DFN-EP-(5X6) = smd 1.1 x 0.5: 1 -2.9,1.905; 2 -2.9,0.635; 3 -2.9,-0.635; 4 -2.9,-1.905; 5 2.9,-1.905; 6 2.9,-0.635; 7 2.9,0.635; 8 2.9,1.905 | smd 3.5 x 4.3: TH 0.75,0
SOT223 = smd 1.219 x 2.235: 1 -2.311,-3.099; 2 0,-3.099; 3 2.311,-3.099 | smd 3.6 x 2.2: 4 0,3.099
R0805 = smd 1.3 x 1.5: 1 -0.95,0; 2 0.95,0
R0402 = smd 0.7 x 0.9: 1 -0.65,0; 2 0.65,0
CTS-219-02 = smd 1.13 x 2.44: 1 -1.27,-4.3; 2 1.27,-4.3; 3 1.27,4.3; 4 -1.27,4.3
SOP65P640X120-16N = smd 1.473 x 0.356: 1 -2.921,2.286; 2 -2.921,1.626; 3 -2.921,0.965; 4 -2.921,0.33; 5 -2.921,-0.33; 6 -2.921,-0.965; 7 -2.921,-1.626; 8 -2.921,-2.286; 9 2.921,-2.286; 10 2.921,-1.626; 11 2.921,-0.965; 12 2.921,-0.33; 13 2.921,0.33; 14 2.921,0.965; 15 2.921,1.626; 16 2.921,2.286
SOT65P210X110-6N = smd 1.168 x 0.356: 1 -0.94,0.66; 2 -0.94,0; 3 -0.94,-0.66; 4 0.94,-0.66; 5 0.94,0; 6 0.94,0.66
SOT23-5L = smd 0.55 x 1.2: 1 -0.95,-1.3; 2 0,-1.3; 3 0.95,-1.3; 4 0.95,1.3; 5 -0.95,1.3
MSOP10 = smd 0.3 x 1: 1 -1,-2.4; 2 -0.5,-2.4; 3 0.005,-2.4; 4 0.5,-2.4; 5 1,-2.4; 6 1,2.4; 7 0.5,2.4; 8 0.005,2.4; 9 -0.5,2.4; 10 -1,2.4 | smd 1.3 x 1.5: EP 0.02,-0.04
TSSOP-28 = smd 0.35 x 1: 1 -4.225,-3.087; 2 -3.575,-3.087; 3 -2.925,-3.087; 4 -2.275,-3.087; 5 -1.625,-3.087; 6 -0.975,-3.087; 7 -0.325,-3.087; 8 0.325,-3.087; 9 0.975,-3.087; 10 1.625,-3.087; 11 2.275,-3.087; 12 2.925,-3.087; 13 3.575,-3.087; 14 4.225,-3.087; 15 4.225,3.087; 16 3.575,3.087; 17 2.925,3.087; 18 2.275,3.087; 19 1.625,3.087; 20 0.975,3.087; 21 0.325,3.087; 22 -0.325,3.087; 23 -0.975,3.087; 24 -1.625,3.087; 25 -2.275,3.087; 26 -2.925,3.087; 27 -3.575,3.087; 28 -4.225,3.087 | smd 5 x 3: EXP 0,0
SOIC127P600X175-8N = smd 1.981 x 0.533: 1 -2.464,1.905; 2 -2.464,0.635; 3 -2.464,-0.635; 4 -2.464,-1.905; 5 2.464,-1.905; 6 2.464,-0.635; 7 2.464,0.635; 8 2.464,1.905
MSTBA2 = drill 1.397 long: 1 -2.54,5.08; 2 2.54,5.08
MSTBA4 = drill 1.397 long: 1 -7.62,5.08; 2 -2.54,5.08; 3 2.54,5.08; 4 7.62,5.08
7395-02 = drill 1.016 square: 1 1.27,0 | drill 1.016 long: 2 -1.27,0
7395-03 = drill 1.016 square: 1 2.54,0 | drill 1.016 long: 2 0,0; 3 -2.54,0
7395-04 = drill 1.016 square: 1 3.81,0 | drill 1.016 long: 2 1.27,0; 3 -1.27,0; 4 -3.81,0

### Placement (x,y rotation side)
3.3V  83.8,55.18 0 top
12..24V  84.05,43.65 0 top
12V  83.05,27.1 0 top
C1  23.88,22.66 270 top
C2  23.9,25.9 270 top
C3  41.65,23.1 270 top
C4  41.62,26.1 270 top
C5  58.15,22.63 270 top
C6  58.16,25.65 270 top
C12  16.95,14.55 90 top
C13  88.3,53.98 270 top
C14  23.05,60.58 270 top
C15  28.95,65.35 180 top
C16  38.48,65.23 180 top
C20  16.75,46.13 180 top
C21  16.75,44.88 180 top
C22  16.75,30.88 180 top
C23  16.75,29.63 180 top
C24  16.75,64.25 180 top
C25  16.75,63 180 top
C26  24.4,60.6 90 top
C27  33.46,19.52 270 top
C30  35.08,19.5 270 top
C31  26.59,19.48 270 top
C32  52.83,19.65 270 top
C33  51.25,19.65 270 top
C34  69.12,19.05 270 top
C35  60.17,19.3 270 top
C38  43.58,19.6 270 top
C39  59.87,36.14 270 top
C40  43.42,36.55 270 top
C41  25.95,36.55 270 top
C42  67.45,19.25 270 top
C45  28.95,62.65 0 top
C46  38.48,62.65 0 top
C52  58.85,50.3 180 top
C53  69.6,43.1 90 top
C54  65.85,55.7 180 top
C55  59.2,52.85 270 top
C56  70.5,53.1 0 top
C57  11.12,56 0 top
C58  11,38.38 0 top
C59  12.88,30.25 90 top
D1  9.88,31.7 270 top
D2  9.88,47.75 270 top
D3  9.88,65.25 270 top
D4  57.2,45.6 270 top
EXPAND  36.55,49.35 270 top
F1  9.85,11.8 90 top
JP1  22.73,55.48 0 top
JP2  93.2,10.55 0 top
L2  63.75,44.95 270 top
LED1  11.12,54.5 90 top
LED2  11,37.13 90 top
LED3  11.5,22.88 90 top
LED4  97.5,43 90 top
LED5  76.22,4.73 0 top
LED6  84.38,4.73 0 top
LED7  93.25,4.73 0 top
LED8  14.88,6.5 270 top
LED9  69.55,23.2 180 top
LED10  52.9,22.9 180 top
LED11  36.1,24 180 top
LOGO1  83.91,62.81 0 top
P8  58.38,10.63 180 top
P9  58.38,59 180 top
Q1  11.5,41.63 180 top
Q2  11.5,59.5 180 top
Q3  11.5,26.13 180 top
Q4  78.97,17.83 0 top
Q5  87.33,18.03 0 top
Q6  96.38,18.08 0 top
R1  31.57,15.9 90 top
R2  28.4,15.9 90 top
R3  48.88,15.9 90 top
R4  45.75,15.9 90 top
R5  65.08,15.6 90 top
R6  61.8,15.6 90 top
R7  69.55,26.3 90 top
R8  52.9,25.5 90 top
R9  36.1,27.15 90 top
R11  97.5,44.25 180 top
R12  32.65,36.5 90 top
R13  29.12,67.68 90 top
R14  11.12,53.13 180 top
R15  11.75,21.63 180 top
R16  11.3,35.9 180 top
R17  38.45,67.68 90 top
R18  48.4,67.68 90 top
R19  76.28,1.78 270 top
R20  84.3,1.78 270 top
R21  93.25,1.78 270 top
R22  97.5,57.25 0 top
R23  97.5,55.88 0 top
R24  97.5,54.63 0 top
R31  14.25,45.75 90 top
R32  14.38,30.25 90 top
R35  50.23,36.7 90 top
R36  66.58,36.5 90 top
R37  14.38,63.5 90 top
R38  21.77,60.58 270 top
R39  29.07,64.05 180 top
R40  38.48,63.88 180 top
R42  70.8,50.25 90 top
R43  69.5,50.25 270 top
R44  70.5,54.35 180 top
R45  14.88,8.13 0 top
R46  16.38,50.88 0 top
R47  16.62,35.75 0 top
R48  18.88,59.83 90 top
R55  9.5,22.38 270 top
R56  8.75,37.5 270 top
R57  8.75,55.13 270 top
S2  92.62,47.88 0 top
U1  29.25,34.38 90 top
U2  46.7,34.38 90 top
U3  63.2,34.08 90 top
U4  49.65,50.5 90 top
U7  15.5,66.75 90 top
U8  15.5,48.5 90 top
U9  15.88,33.25 90 top
U10  64.2,53.1 270 top
U13  29.88,24.88 0 top
U14  47.33,24.88 0 top
U15  63.83,24.58 0 top
U18  92.75,56.63 180 top
U$1  [LOGO_BIG]  80.05,65.15 0 top
U$3  71.85,65.6 0 top
X1  -1.2,45.6 270 top
X2  -1.02,11.25 270 top
X3  -1.02,28.65 270 top
X4  79.6,5.35 0 top
X5  87.7,5.35 0 top
X6  96.65,5.25 0 top
X7  43.15,64.2 180 top
X8  33.7,64.1 180 top
X9  24.35,64.05 180 top
X14  30.8,5.35 0 top
X15  47.6,5.15 0 top
X16  63.9,5.2 0 top
X21  -1.02,63.45 270 top

### Tracks (layer width: path | path; a pad name or v marks a point on that pad's centre or on a via)
+3V3  (via drill 0.3, 0.4)
  Top 0.152: R23.2 R22.2 | U18.8 90.29,53.92 v90.35,53.85 | v98.15,53.75 R24.2 | 83.75,60.13 83.78,60.15 P9.3 | P9.4 83.88,57.63 | U2.16 44.41,36.27 v44.4,36.25 | v51.35,36.95 50.62,36.95 R35.2 50.23,45.73 51.25,46.75 51.25,50.15 50.95,50.45 50.05,50.45 49.6,50.9 49.6,51.39 U4.5 | v58.95,36.8 C39.1
  Top 0.254: 90.25,54.75 U18.8 | 88.25,54.65 C13.1 | R24.2 98.12,54.75 98.12,55.88 R23.2 | C41.1 26.86,37.2 U1.16 | C40.1 44.31,37.2 U2.16 | C39.1 60.71,36.79 U3.16
  Top 0.3: 83.88,57.63 83.88,55.25 3.3V.TP 83.92,55.05 | C13.1 84.35,54.63 83.92,55.05 | 83.92,55.05 83.75,55.05 81.35,52.65 v81.35,37.2 | 67.4,37.1 67.35,37.15 R36.2 66.62,37.1 v67.45,37.1 | U1.16 26.96,36.04 v27,36 | v33.65,36.95 32.85,36.95 R12.2 | v42.4,36.6 42.4,36.9 42.7,37.2 C40.1
  Top 0.305: 60.9,36.98 U3.16
  Top 0.406: 83.88,57.63 84.17,57.63
  Top 0.41: 90.25,54.75 88.42,54.75 C13.1
  Top 1: 83.75,60.13 83.78,60.1 P9.4
  Bottom 0.152: v90.35,53.85 98.05,53.85 v98.15,53.75 | v44.4,36.25 44.45,36.25 45.15,36.95 v51.35,36.95 58.8,36.95 v58.95,36.8
  Bottom 0.3: v81.35,37.2 81.25,37.1 v67.45,37.1 | v67.45,37.1 67.4,37.1 | v67.45,37.1 67.15,36.8 v58.95,36.8 | v27,36 27.25,36 28.2,36.95 v33.65,36.95 42.05,36.95 v42.4,36.6
A1_X
  Top 0.4: U13.5 28.25,18.85 27.05,17.65 27.05,5.41 X14.4
A2_X
  Top 0.4: U13.7 29.55,13.35 29,12.8 29,5.88 X14.3
AGND
  Top 0.152: 29.62,62.75 C45.2 | C14.2 24.38,61.25 C26.2 | C15.2 28.25,65.38 28,65.38 27.38,66 26.25,66 24.38,64.13 X9.2 24.38,64 | 37.88,65.13 38.5,64.5 38.5,63.38 39.12,62.63 C46.2 | 43.12,64.13 X7.2 | 33.75,64.13 X8.2 | 37.88,65.25 C16.2 | P9.34 45.62,57.75 45.5,57.75
  Top 0.254: 29.62,62.75 32.38,62.75 33.62,64 X8.2 | 24.38,64 24.38,61.75 | 24.38,61.75 24.38,61.25 | 24.38,61.75 28.75,61.75 29.62,62.63 C45.2 | 37.88,65.13 C16.2 | 43.12,62.63 39.12,62.63 | 43.12,64.13 43.12,62.63 | 43.12,62.63 44.25,61.5 44.25,59 45.5,57.75 45.59,57.66 | 33.75,64.13 35.62,66 37.12,66 37.88,65.25
B1_X
  Top 0.4: U13.10 31.5,19.15 33.65,17 33.65,14.15 34.3,13.5 34.3,5.66 X14.1
DIR_EXT_3  (via drill 0.4)
  Top 0.152: U13.20 30.85,29 v30.75,29 | v37.05,30.5 37.05,32.25 v49,44.2 | v73.25,44.35 73.25,54.15 71.05,56.35 71.05,57.71 P9.14
  Bottom 0.152: v30.75,29 32.2,30.45 37,30.45 v37.05,30.5 | v49,44.2 73.1,44.2 v73.25,44.35
DIR_EXT_4  (via drill 0.3, 0.4)
  Top 0.152: U14.20 48.3,28.8 v48.2,28.9 | v79.85,35.15 79.85,48.6 72.55,55.9 72.55,58.25 71.85,58.95 67.31,58.95 P9.17 | v59.5,29.35 59.5,32.15 v59.2,32.45
  Bottom 0.152: v59.2,32.45 59.85,31.8 76.5,31.8 77.15,32.45 v79.85,35.15 | v48.2,28.9 48.4,28.9 49.25,29.75 56.6,29.75 57.1,29.25 59.4,29.25 v59.5,29.35
DIR_EXT_5  (via drill 0.4)
  Top 0.152: U15.20 64.8,28.5 v64.2,29.1 | v53.25,33.75 53.25,54.15 54.6,55.5 54.6,58.97 P9.27
  Bottom 0.152: v64.2,29.1 63.6,29.7 60.35,29.7 60,30.05 59.15,30.05 58.8,29.7 57.3,29.7 v53.25,33.75
FAN4  (via drill 0.4)
  Top 0.152: EXPAND.9 35.28,36.87 35.25,36.85 35.25,35.45 33.6,33.8 v33.6,33.65 | v75.7,33.95 75.7,17.7 76.65,16.75 Q4.1
  Bottom 0.152: v33.6,33.65 33.9,33.95 41.2,33.95 42.15,33 47.45,33 49.3,34.85 58.2,34.85 60.45,32.65 74.4,32.65 v75.7,33.95
FAN5  (via drill 0.4)
  Top 0.152: Q5.1 85.01,17.49 v84.8,17.7 | v77.05,17.7 77,17.7 76.3,18.4 76.3,33.1 v76.6,33.4 | v36.1,33.3 36.1,34.8 40.85,39.55 40.85,46.7 v41.05,46.9
  Bottom 0.152: v84.8,17.7 v77.05,17.7 | v76.6,33.4 76.45,33.4 75.35,32.3 60.25,32.3 58.2,34.35 49.35,34.35 47.65,32.65 41.65,32.65 40.9,33.4 36.2,33.4 v36.1,33.3 | v41.05,46.9 37.91,46.9 EXPAND.8
FAN6  (via drill 0.4)
  Top 0.152: EXPAND.7 35.06,46.81 34.05,45.8 34.1,37.5 34.55,37.05 34.55,35.65 v33.65,34.75 | v81.4,35.85 83.45,35.85 85,34.3 85,23.5 v85.65,22.85 | Q6.1 94.3,15.21 94.3,19.05 v94.35,19.1
  Bottom 0.152: v33.65,34.75 41,34.75 42.4,33.35 47.3,33.35 49.25,35.3 58.25,35.3 60.55,33 73.75,33 75.55,34.8 78.45,34.8 79.5,35.85 v81.4,35.85 | v94.35,19.1 92.25,19.1 88.5,22.85 v85.65,22.85
FAULT_EXT_3  (via drill 0.4)
  Top 0.152: U13.18 32.15,29.1 v32.1,29.15 | v36.1,29.15 R9.2 36.1,32.3 48.9,45.1 48.9,49.47 U4.1
  Bottom 0.152: v32.1,29.15 v36.1,29.15
FAULT_EXT_4  (via drill 0.4)
  Top 0.152: U4.3 50.31,46.66 49.55,45.9 49.55,44.95 49.7,44.8 49.7,43.7 49.55,43.55 v49.55,39.25 | U14.18 v49.6,28.9 | R8.2 52.9,26.95 53.05,27.1 v53.05,28.95 52.9,29.1 52.9,33.15 52.6,33.45 52.6,34.05 52.85,34.3 52.85,39.05 v52.6,39.3
  Bottom 0.152: v49.55,39.25 51.7,39.25 51.75,39.3 v52.6,39.3 | 53.05,29 v53.05,28.95 53.05,28.9 v49.6,28.9
FAULT_EXT_5  (via drill 0.3, 0.4)
  Top 0.152: U15.18 v66.1,28.95 | R7.2 69.5,27 v69.5,29.05 69.5,39.1 v68.65,39.95 | v43.55,40.7 43.55,40.8 48.2,45.45 48.2,51.25 48.35,51.4 48.95,51.4 U4.6
  Bottom 0.152: v68.65,39.95 57.7,39.95 56.95,40.7 v43.55,40.7 | v66.1,28.95 69.4,28.95 v69.5,29.05
FAULT_REACH
  Top 0.152: P9.29 50.76,59.96 49.6,58.8 49.6,53.5 50.3,52.8 U4.4
GND  (via drill 0.3)
  Top 0.254: 14.62,36 14.12,36.5 14.12,38.38 C58.2 | 13.38,56 C57.2 | 14.5,24.25 13.12,24.25
  other vias: 16.38,24.25 15.38,24.25 15.38,25.5 16.38,25.5 15.38,26.75 16.38,26.75 15.5,60.13 16.62,60.13 15.5,58.88 16.62,58.88 15.5,57.63 16.62,57.63 16.62,39.75 15.5,39.75 15.5,41 16.62,41 15.5,42.25 16.62,42.25 43.27,15.8 43.27,17.45 43.27,16.65 43.27,15 47.33,24.5 47.33,25.25 47.33,26 47.33,23.75 27.88,23.75 31.88,23.75 31.88,26 27.88,26 51.6,23.98 51.6,23.23 63.6,34.43 63.58,33.7 62.83,33.7 62.83,34.45 61.83,23.45 65.83,23.45 65.83,25.7 61.83,25.7 25.93,34.7 63.83,25.7 62.83,25.7 63.83,23.45 64.83,23.45 62.83,23.45 64.83,25.7 61.83,24.95 61.83,24.2 62.83,24.2 62.83,24.95 63.83,24.95 63.83,24.2 64.83,24.2 64.83,24.95 65.83,24.95 65.83,24.2 45.33,26 45.33,23.75 49.33,23.75 49.33,26 46.33,26 46.33,25.25 45.33,25.25 45.33,24.5 46.33,24.5 46.33,23.75 48.33,23.75 48.33,24.5 48.33,25.25 48.33,26 49.33,25.25 49.33,24.5 29.88,26 29.88,23.75 29.88,24.5 29.88,25.25 28.88,26 28.88,25.25 28.88,24.5 28.88,23.75 27.88,24.5 27.88,25.25 30.88,26 30.88,25.25 30.88,24.5 30.88,23.75 31.88,24.5 31.88,25.25 34.05,23.13 34.05,23.93 45.12,13.5 46.02,13.5 49.88,13.6 50.67,13.65 51.23,18.05 52.77,17.65 59.58,17.45 59.58,16.7 60.83,13.3 61.58,13.3 65.22,13.3 66.08,13.3 67.42,16.7 68.22,16.75 67.42,15.9 68.22,15.95 34.58,16.95 35.27,16.95 34.58,16.25 35.27,16.25 68.03,22.9 68.03,23.65 46.33,34.75 47.08,34.75 46.33,34 47.08,34 92.65,44.13 28.88,34.75 29.62,34.75 29.62,34 28.88,34 43.42,34.75 60.08,34.45 27.98,13.6 28.77,13.65 31.73,13.65 32.48,13.65 14.53,35.9 14.38,50.8 15.18,45.45 15.47,48.5 15.88,33.2 15.22,30.2 15.53,66.75 15.22,63.5 98.65,12.88 59.83,25.95 60.67,25.95 43.23,26.55 43.98,26.55 25.52,26.5 26.48,26.5 59.58,16 98.72,17.25 92.6,42.98 49.6,48.15 64.78,50.3 65.53,50.3 64.78,49.55 65.53,49.55 89.53,17.1 81.17,16.85 21.52,42.53 22.43,42.53 23.32,42.48 24.27,42.48 21.48,40.23 22.32,40.23 23.27,40.23 24.27,40.23 21.93,15.15 22.73,15.15 21.93,14.35 22.73,14.4
  pour Top: 12.88,69.5 98.75,69.58 arc-90 100,68.5 100,41.75 86.75,41.75 86.75,23.63 100,23.63 100,1.25 arc-90 98.75,0 14.38,0 14.38,22.5 12.88,22.5
  pour Bottom (isolate 0.254): 98.75,69.58 14,69.5 14,14.5 6,14.5 6,20 0,20 0,0 98.75,0 arc90 100,1.25 100,23.63 86.75,23.63 86.75,41.75 100,41.75 100,68.5 arc90
  pour Bottom (no thermals): 0.95,20 0.95,11.95 6.3,12 6.3,20
HEATER_EXT3  (via drill 0.35, 0.4)
  Top 0.152: 17.38,34.25 U9.3 | 17.25,35.63 R47.2 17.27,37.48 v17.3,37.5 | 17.12,34.5 17.25,34.5 | v19.75,37.55 19.75,48.1 v19.7,48.15
  Top 0.254: 17.25,34.25 17.12,34.25 U9.3 | 17.25,34.13 U9.3 | 17.25,35.75 R47.2 | 17.25,35.63 17.25,34.5 17.25,34.38 U9.3
  Bottom 0.152: v19.7,48.15 34.08,48.15 EXPAND.5 | v17.3,37.5 19.7,37.5 v19.75,37.55
HEATER_EXT4  (via drill 0.3)
  Top 0.152: 16.88,49.5 17,49.63 17,50.75 R46.2 | 16.75,49.38 U8.3 16.82,49.48 v17.93,49.48
  Top 0.254: 17.12,51 R46.2 | 16.85,49.5 16.88,49.5 16.75,49.38
  Bottom 0.152: v17.93,49.48 32.87,49.48 EXPAND.3
HEATER_EXT5  (via drill 0.35)
  Top 0.152: 16.88,67.75 18.38,67.75 18.88,67.25 R48.2 19.52,60.48 19.9,60.1 v19.9,54.25
  Top 0.254: 16.88,67.75 U7.3 | 18.85,61.65 18.85,60.5 R48.2
  Bottom 0.152: v19.9,54.25 35.1,54.25 EXPAND.1
I2C2_SCL  (via drill 0.5)
  Top 0.152: 90.25,57.25 U18.6
  Top 0.154: v92,57.2 90.4,57.2 U18.6
  Top 0.254: 90.25,57.25 90,57.25 90,57.4
  Bottom 0.152: P9.19 64.07,60.27 66,62.2 89,62.2
  Bottom 0.154: 89,62.2 92,59.2 v92,57.2
I2C2_SDA  (via drill 0.3)
  Top 0.152: 90.38,58.63 U18.5 90.25,58.63 v90.25,60
  Bottom 0.152: v90.25,60 90.25,60.13 88.62,61.75 80.5,61.75 79.9,61.15 79.9,57 79.2,56.3 64.89,56.3 P9.20
N$2
  Top 0.4: X14.2 32.07,7.23 31.7,7.6 31.7,12.5 30.4,13.8 30.4,18.1 30.2,18.3 U13.8
N$3
  Top 0.4: U14.8 47.65,13.65 47.95,13.35 48.75,13.35 49.45,12.65 49.45,7.9 48.85,7.3 48.85,5.17 X15.2
N$4
  Top 0.4: U15.10 65.45,18.8 66.7,17.55 66.7,13.85 67.3,13.25 67.3,6.8 67.7,6.4 X16.1
N$5
  Top 0.4: U15.8 64.15,17.8 63.8,17.45 63.8,13.5 64.75,12.55 64.75,7.7 65.15,7.3 65.15,5.22 X16.2
N$6
  Top 0.152: LED9.A R7.1
N$8
  Top 0.254: LED8.C 15.5,6.63 R45.2
N$9
  Top 0.254: LED5.A 76.25,3.88 76.25,2.63 76.12,2.5 R19.1
N$11
  Top 0.152: R8.1 LED10.A
N$13
  Top 0.152: R9.1 LED11.A
N$16
  Top 0.152: C1.1 25.44,23.31 26.25,22.5 26.25,21.84 U13.2
N$17
  Top 0.152: 25.62,21.75 24.13,21.75 C1.2
  Top 0.254: 25.62,21.75 25.62,21.5 U13.1 25.62,21.75
N$18
  Top 0.152: 31.82,16.75 31.82,16.78 31.9,16.85
  Top 0.41: U13.9 30.88,21.75 30.88,18.45 31.25,18.07 31.9,17.45 31.9,16.85 31.9,16.63 | 31.82,16.75 R1.2
N$19
  Top 0.41: U13.6 28.88,21.75 28.88,19.5 28.85,18.73 28.85,16.6 R2.2
N$21
  Top 0.152: 14.38,32.13 14.5,32.13 14.5,32.25 U9.5
  Top 0.254: R32.2 14.38,32.13
N$22
  Top 0.152: U13.3 26.95,22.6 24.55,25 24.14,25 C2.2
N$23
  Top 0.254: Q2.4 14.38,61.5 R37.1
N$34
  Top 0.152: U14.2 43.75,22.45 42.6,23.6 41.4,23.6 C3.1
N$35
  Top 0.152: U14.1 42.31,21.79 C3.2
N$36
  Top 0.41: U14.9 48.33,21.75 48.33,18.3 48.7,17.93 48.7,16.75 48.58,16.75 R3.2
N$37
  Top 0.152: R4.2 45.7,16.85
  Top 0.41: U14.6 46.33,21.75 46.33,18.68 45.7,18.05 45.7,16.85 45.7,16.75
N$38
  Top 0.152: U14.3 44.4,22.68 C4.2
N$41
  Top 0.152: U7.5 14.5,65.63 14.38,65.63
  Top 0.254: R37.2 14.38,65.63
N$52
  Top 0.152: U15.2 60.25,22.05 59.2,23.1 57.9,23.1 C5.1
N$53
  Top 0.152: U15.1 58.61,21.49 C5.2
N$54
  Top 0.41: U15.9 64.83,21.45 64.83,18.45 65.08,18.2 65.08,16.7 64.83,16.45 65.08,16.45 R5.2
N$55
  Top 0.41: U15.6 62.83,21.45 62.83,18.63 62.33,18.13 62.33,16.83 62.08,16.83 R6.2
N$56
  Top 0.152: U15.3 60.9,22.3 58.25,24.95 C6.2
N$60
  Top 0.254: Q1.4 14.25,43.63 14.25,45.13 14.38,45.13 R31.1
N$61
  Top 0.152: 14.25,47.5 U8.5
  Top 0.254: 14.25,47.5 R31.2
N$64
  Top 0.152: R57.1 8.75,55.75 10.25,55.75 C57.1
  Top 0.254: 10.38,56 LED1.C | 10.38,56 C57.1 | 10.38,56 10.38,57.63 8.62,57.63 Q2.8 8.5,57.5 8.62,57.75 | Q2.6 8.5,60.25 8.5,60.91 8.5,61.38 Q2.5 | 9.88,60.75 10.75,60.25 Q2.TH 10.75,58.88 8.62,58.88 Q2.7 8.5,58.75 8.5,58.63 8.62,59.88
  Top 0.813: 8.62,57.75 8.62,59.88
  Top 2: D3.A 9.88,60.75 9.75,60.88 9.62,60.91
  Top 2.54: X21.2 8.5,60.91 9.62,60.91
N$96
  Top 0.152: 98.25,44.25 LED4.A
  Top 0.3: 98.25,44.25 R11.1
N$97
  Top 0.152: U1.10 30.88,36.13 31.15,35.85 R12.1
N$100
  Top 0.152: R35.1 50.08,36 48.95,36 48.45,36.5 48.45,37.25 U2.10
N$101
  Top 0.152: R36.1 66.58,35.7 65.45,35.7 64.95,36.2 64.95,36.95 U3.10
N$114
  Top 0.152: X6.2 93.25,5.25 LED7.C | Q6.2 Q6.4
  Top 0.41: Q6.2 96.38,6.13 95.5,5.25 X6.2
N$115
  Top 0.152: LED6.C 84.45,5.38 86.33,5.38 X5.2
  Top 0.3: Q5.2 87.33,13.93 | 87.03,5.88 86.96,5.88
  Top 0.41: Q5.2 Q5.4 | 87.33,13.93 88.1,13.15 88.1,6.95 87.03,5.88 | 86.96,5.88 X5.2
N$116
  Top 0.152: LED5.C 76.25,5.38 78.25,5.38 X4.2
  Top 0.3: Q4.2 78.95,14.7 78.95,14.15 77.4,12.6 77.4,8.05 78.38,7.08 78.38,5.38 78.35,5.35 X4.2
  Top 0.41: Q4.4 79.03,21 79.03,14.88 Q4.2 79.12,14.68
N$117
  Top 0.254: LED6.A 84.33,3.88 84.33,2.38 R20.1
N$118
  Top 0.254: R21.1 LED7.A
N$127
  Top 0.152: LED3.A 12.25,21.75 12.38,21.63 R15.1
N$129
  Top 0.254: LED1.A 11.88,53.25 R14.1
N$130
  Top 0.152: LED2.A 11.75,35.88 11.88,35.75 R16.1
N$133
  Top 0.254: Q3.4 14.38,28.13 R32.1
N$147
  Top 0.152: 96.88,54.63 R24.1 95.25,54.63 U18.1 95.12,54.63 95.12,53.38 94,52.25 S2.3
N$148
  Top 0.152: R23.1 95.25,55.88 U18.2 95.12,55.88 94.75,55.88 91.38,52.5 91.38,52.25 S2.4
N$149
  Top 0.152: R22.1 95.25,57.25 U18.3
N$233
  Top 0.3: U10.7 67.6,52.6 68.4,51.8 68.6,51.8 R43.1 R42.2
N$234
  Top 0.152: LED3.C Q3.TH 9.5,24.13 R55.1 | C59.1 12.88,29.5 10.75,29.5 D1.A | Q3.8 8.62,24.25 8.62,24.38
  Top 0.254: 9.88,24.5 9.88,25 | 8.5,26.12 8.5,26.75 Q3.6 | 8.5,26.12 8.5,25.5 Q3.7 | 8.5,26.63 9.88,26.75 | 8.5,27.88 8.5,28 Q3.5 | 9.88,26.38 Q3.TH 9.62,25.63 8.62,25.63
  Top 0.813: 8.5,27.88 8.5,26.63 | 8.62,24.38 8.62,25.63
  Top 2: D1.A 9.88,26.75 9.88,26.38 | 9.88,26.38 9.88,25 | 8.5,26.12 9.62,26.13 9.88,26.38
  Top 2.54: X3.2 8.5,26.12
N$237
  Top 0.152: C14.1 23,61.25 21.88,61.25 R38.1 21.75,61.25 21.75,64 X9.1 21.88,64.13 24.62,66.88 29.12,66.88 R13.1
N$238
  Top 0.3: L2.P$2 63.75,50.15 U10.5 59.4,52.1 C55.2
  Top 1: L2.P$2 57.35,47.75 D4.C
N$240
  Top 0.152: C16.1 39.12,64.25 | R18.1 48.38,67.13 43.5,67.13 40.62,64.25 X7.1 40.5,64.25 39.12,64.25 | 39.12,64.25 R40.1
N$241
  Top 0.152: C15.1 29.62,65.25 29.62,64.13 R39.1 29.75,64.13 31.12,64.13 X8.1 31.25,64.13 34.12,67 38.38,67 R17.1
N$242
  Top 0.152: R56.1 8.75,39.5 Q1.8
  Top 0.254: 9.62,39.75 9.62,41 | LED2.C 10.25,38.13 | 10.25,38.13 10.25,39.63 8.38,39.63 Q1.8 8.5,39.75 9,41 | 10.25,38.13 C58.1 | 8.25,42.25 8.5,42.25 | 9,42.25 8.5,42.25 | 8.5,42.25 Q1.6 | 9,42.25 9,41 | Q1.TH 9.88,41.63 | 8.5,43.25 8.62,43.5 Q1.5 | 8.5,42.63 8.5,42.25 | 9,42.25 9.88,42.25 | 9,41 8.5,40.88 Q1.7
  Top 0.813: 8.5,43.25 8.5,42.63
  Top 2: D2.A 9.88,42.25 9.88,41.63 9.88,41.13 9.62,41
  Top 2.54: 9.62,41 9,41 | X1.2 3.88,41.13 9.88,41.13
N$243
  Top 0.3: U10.10 66.6,55.6 C54.1
N$244
  Top 0.3: C56.1 U10.8
N$245
  Top 0.3: U10.2 59.3,53.6 C55.1
N$246
  Top 0.3: R44.1 C56.2
SER6  (via drill 0.4)
  Top 0.152: U1.14 28.29,42.79 v28.3,42.8
  Bottom 0.152: v28.3,42.8 36.35,42.8 EXPAND.10
SER_7  (via drill 0.3)
  Top 0.152: U1.9 31.54,38.52 v31.5,38.55 | v45.75,38.55 45.75,37.31 U2.14
  Bottom 0.152: v31.5,38.55 v45.75,38.55
SER_8  (via drill 0.3)
  Top 0.152: U2.9 v49,38.45 | v62.25,38.2 62.23,38.19 U3.14
  Bottom 0.152: v49,38.45 49.05,38.5 49.05,38.45 49.55,37.95 62,37.95 v62.25,38.2
SPI1_CS1  (via drill 0.3, 0.4)
  Top 0.152: 63.5,37.7 63.5,37.13 U3.12 63.58,36.95 | 63.58,36.95 63.58,36.33 | U1.12 29.62,37.38 v29.62,38.5 29.62,40.03 33.05,43.45 33.05,54.2 35.5,56.65 35.5,57.73 P9.42 | U2.12 47.08,37.34 v47.08,38.5 47.05,38.53 | 63.58,36.95 63.58,37.48 63.45,37.6 63.45,37.65 63.5,37.7 | 63.5,37.7 v63.5,38.1
  Bottom 0.152: 47.08,38.23 46.4,37.55 30.57,37.55 v29.62,38.5 | v47.08,38.5 47.08,38.23 | 47.08,38.23 47.75,37.55 62.95,37.55 v63.5,38.1 63.5,38.2
SPI1_SCLK  (via drill 0.3, 0.4)
  Top 0.152: U1.11 30.21,36.22 30.2,36.2 v30.2,36.05 | v47.65,36.05 47.65,37.28 U2.11 47.66,41.87 v48.8,43 | U3.11 64.17,35.74 v64.2,35.7 | v44.4,43.2 44.4,53.1 46.95,55.65 46.95,59.01 P9.31
  Bottom 0.152: v30.2,36.05 41.9,36.05 42.05,35.9 42.8,35.9 42.95,36.05 43.7,36.05 44.1,35.65 44.7,35.65 45.1,36.05 v47.65,36.05 | 47.7,36 v47.65,36.05 | v64.2,35.7 64.15,35.7 64.1,35.75 47.95,35.75 v47.65,36.05 | v48.8,43 44.6,43 v44.4,43.2
STEP1_Y
  Top 0.4: U14.5 45.7,19.05 44.35,17.7 44.35,5.71 X15.4
STEP1_Z
  Top 0.4: U15.5 62.2,19.05 60.5,17.35 60.5,14 59.75,13.25 59.75,7.85 60.1,7.5 X16.4
STEP2_Y
  Top 0.4: U14.7 47,12.8 46.95,12.75 46.95,5.77 X15.3
STEP2_Z
  Top 0.4: U15.7 63.5,18.2 63,17.7 63,13.4 62.25,12.65 62.25,7.7 62.6,7.35 62.6,5.23 X16.3
STEP3_Y
  Top 0.4: X15.1 51.41,7.81 52.05,8.45 52.05,15.8 48.95,18.9 U14.10
STEP_EXT_3  (via drill 0.4)
  Top 0.152: U13.22 29.55,28.55 v28.95,29.15 | v74.45,28 74.45,13.7 75,13.15 75,10.9 v74.95,10.85
  Bottom 0.152: v28.95,29.15 28.95,29.1 29.75,28.3 29.85,28.3 30.2,27.95 74.4,27.95 v74.45,28 | v74.95,10.85 75,10.85 75.1,10.75 77.55,10.75 P8.7
STEP_EXT_4  (via drill 0.3, 0.4)
  Top 0.152: U14.22 v47,29.15 | v51.5,33.65 51.5,35.7 52.05,36.25 52.05,38.1 51.45,38.7 51.45,39.7 52.35,40.6 52.35,51 51.7,51.65 51.7,56.7 52,57 52,59.05 v51.9,59.15
  Bottom 0.152: v47,29.15 v51.5,33.65 | v51.9,59.15 67.42,59.15 P9.15
STEP_EXT_5  (via drill 0.4)
  Top 0.152: U15.22 63.5,28.05 v62.85,28.7 | v56.5,28.75 56.5,39.4 56.8,39.7 56.8,40.65 55.35,42.1 55.35,52.2 59.7,56.55 59.7,59.06 P9.21
  Bottom 0.152: v62.85,28.7 62.75,28.8 60.35,28.8 60.05,28.5 59.05,28.5 58.75,28.8 56.55,28.8 v56.5,28.75
TERM_EXT3
  Top 0.152: R40.2 37.88,63.88 37.88,62.75 C46.1 37.88,62.63 37.88,62.28 38.35,61.8 39.06,61.8 P9.37
TERM_EXT4  (via drill 0.3)
  Top 0.152: C45.1 28.38,62.75 28.38,64 R39.2 28.5,64.13 28.5,64.38 29,64.88 29,65.88 29.38,66.25 32.88,66.25 34.25,67.63 v35.5,67.63
  Bottom 0.152: v35.5,67.63 39.25,63.88 39.25,60.95 39.35,60.85 39.35,58.98 P9.38
TERM_EXT5
  Top 0.152: R38.2 21.88,59.88 22.5,59.25 23.75,59.25 24.38,59.88 C26.1 24.5,59.88 29.25,59.88 30,59.13 36.91,59.13 P9.39
VDD_5V
  Bottom 0.152: P9.5 P9.6
VDD_12V  (via drill 0.4)
  Top 0.152: 17.23,33.2 U9.2 18.1,33.25
  Top 0.254: U7.2 17.88,66.75 18,66.63 18,65.38 17.38,64.75 C24.1 17.38,64.25 17.38,63 C25.1 17.38,62.88 17.38,52.38 18.6,51.15 18.6,49.1 | 17.38,29.63 C23.1 | 17.38,30.75 C22.1 | C21.1 17.38,45 17.38,46.13 C20.1 17.38,46.25 17.48,46.28
  Top 0.3: 17.38,30.75 17.38,29.63 | 17.48,46.28 17.88,46.63 18,46.75 18,48.5 | U8.2 18,48.5 | 18,48.5 18.6,49.1 | C22.1 17.77,30.88 18.45,31.55 18.45,32.9 18.15,33.2 17.23,33.2 | 18.1,33.25 18.4,33.55 v18.4,41.3 18.4,43.88 C21.1 | R42.1 70.8,45.7 71.3,45.2 71.3,43.25 70.25,42.2 69.65,42.2 C53.1 | L2.P$1 59.7,42.15 v58.8,41.25
  Top 0.813: 80.88,1.13 R20.2 | 88.95,1.13 R21.2
  Top 0.819: R21.2 97.88,1.13 97.88,5.25 X6.1 98,5.33 v98,11.2 | X4.1 80.88,5.25 80.88,1.13 R19.2 | R20.2 88.95,1.13 88.95,2.38 X5.1 | v83.05,21.05 12V.TP 83.05,28.7 C53.1
  Top 1: L2.P$1 C53.1
  Bottom 0.3: v58.8,41.25 44.4,41.25 44.25,41.4 43.15,41.4 43,41.25 18.45,41.25 v18.4,41.3
  Bottom 0.819: v83.05,21.05 88.15,21.05 v98,11.2
VDD_ADC  (via drill 0.3)
  Top 0.152: 38.25,68.25 38.38,68.38 R17.2 38.5,68.25 | 29.12,68.25 R13.2 | 48.38,68.25 R18.2
  Top 0.254: 38.25,68.25 29.12,68.25 | 38.5,68.25 47,68.23 | 47,68.23 48.38,68.25 | 47,68.23 v47,68.21
  Bottom 0.152: 48.12,57.75 48.2,57.75 P9.32
  Bottom 0.254: 48.12,57.75 47,58.88 v47,68.21
VDD_IN  (via drill 0.4, 0.6)
  Top 0.152: U13.4 27.6,22.55 24.75,25.4 24.75,26.1 24.55,26.3 24.04,26.3 C2.1 | U14.4 45.05,22.55 42.5,25.1 42.5,25.88 C4.1 | C6.1 58.35,26.25 60.7,23.9 60.7,23.1 61.6,22.2 61.6,21.54 U15.4 | F1.3 13.12,18
  Top 0.3: R11.2 96.85,45.9 v96.9,45.95
  Top 0.35: U10.4 60.75,52.6 v60.45,52.9
  Top 0.4: 17.12,18 C12.+ 17.12,17.75 | R45.1 14.12,8.13 14.12,18
  Top 0.406: 49.58,21.88 U14.11 | v25.27,20.13 27.2,20.1 27.62,20.53 27.62,21.75 U13.4
  Top 0.41: U14.11 49.58,21.75 49.58,20.38 v49.83,20.13 51.25,20.13 C33.1 52.73,20.3 C32.1 | U15.11 66.08,21.45 66.08,20.25 v66.33,20 66.53,19.9 C42.1 | U13.11 32.12,21.75 32.12,20.38 v32.38,20.13 33.46,20.13 C27.1 34.9,20.17 C30.1 | U15.4 61.58,21.45 61.58,20.33 v61.33,20.08 60.2,20.08 C35.1 | U14.4 45.08,21.75 45.08,20.5 v44.7,20.13 43.58,20.13 C38.1 | v25.27,20.13 C31.1 | C31.1
  Top 0.5: C42.1 C34.1 | C35.1 61.2,19.95 61.35,20.1 | 12..24V.TP v84.05,45.9
  Top 1: C52.1 v61.6,50.3 | v54.3,50.3 v54.3,45.95 54.3,21.95 v56,20.25
  Top 1.422: v25.27,20.13 22.95,20.1 22.75,20.1 19.65,17.8 16.65,17.8 16.45,18
  Top 2: 13.12,18 14.12,18 16.45,18 17.12,18
  Bottom 0.3: v96.9,45.95 83.95,45.95 54.2,45.95
  Bottom 0.4: v60.45,52.9 60.45,50.5 C52.1
  Bottom 0.5: 56.15,20.1 61.3,20.1 v61.33,20.08 | 54.2,45.95 v54.3,45.95 | v84.05,45.9 84.05,45.85 83.95,45.95
  Bottom 1: v61.6,50.3 C52.1 v54.3,50.3 | v56,20.25 56.15,20.1
  Bottom 1.422: v25.27,20.13 v32.38,20.13 v44.7,20.13 v49.83,20.13 49.85,20.1 56.15,20.1 66.22,20.1 v66.33,20
  pour Top (isolate 0.5, no thermals): 13.03,15.35 6.95,15.35 6.95,20.7 0,20.7 0,69.5 11.38,69.5 10.88,21.75 13.03,21.75
  pour Bottom (isolate 0.5, no thermals): 13,69.5 13,15.33 7,15.33 7,20.7 0,20.7 0,69.5
VIN
  Top 0.254: 13.38,6.5 LED8.A
  Top 1.27: 4.5,5.63 4,5.25
  Top 2: X2.3 4,5.25 X2.4
  pour Top (no thermals): 0,10.5 13.38,10.5 13.38,0 0,0
VREF_EXT3
  Top 0.152: U13.12 32.88,21.88 32.88,22.63 33.5,23.25 33.5,25.85 34.6,26.95 34.6,34.25 40.45,40.1 40.45,51.8 EXPAND.2 | 33.38,21.88 U13.13
  Top 0.154: U13.13 33.5,21.88 33.5,23.25
VREF_EXT4  (via drill 0.4)
  Top 0.152: 50.95,23 50.95,21.88 U14.13 50.83,21.75 | 50.95,23 50.95,26.25 52.45,27.75 52.45,28.45 52.2,28.7 52.2,35.8 52.4,36 52.4,38.45 51.95,38.95 51.95,39.6 52.75,40.4 52.75,51.65 v52.5,51.9 | U14.12 50.33,21.75 50.33,22.38 50.95,23
  Bottom 0.152: v52.5,51.9 EXPAND.4
VREF_EXT5  (via drill 0.4)
  Top 0.152: 67.33,22.95 67.33,21.58 U15.13 67.33,21.45 | U15.12 66.83,21.45 66.83,22.45 67.33,22.95 | 67.33,22.95 67.33,26.63 v67.3,26.6 | v55.85,26.65 v55.85,40.05 | v41.5,40.1 41.5,46.1 41.8,46.4 41.8,47.4 41.5,47.7 41.5,49.35 v41.6,49.45
  Bottom 0.152: v67.3,26.6 55.9,26.6 v55.85,26.65 | v55.85,40.05 55.7,40.2 44.2,40.2 44.1,40.1 43.15,40.1 43.05,40.2 41.6,40.2 v41.5,40.1 | v41.6,49.45 37.92,49.45 EXPAND.6
X_DECAY
  Top 0.152: U13.19 31.5,29.25 31.15,29.6 30.75,29.6 29.62,30.75 29.62,31.38 U1.5
X_MODE0
  Top 0.152: U13.24 28.25,31.38 U1.3
X_MODE1
  Top 0.152: U13.25 27.62,28 27.62,31.38 U1.2
X_MODE2
  Top 0.152: U13.26 27,28 27,31.38 U1.1
X_NENABLE
  Top 0.152: U13.21 30.12,28 30.12,28.68 29.7,29.1 29.7,29.45 28.9,30.25 28.9,31.44 U1.4 29,31.38
X_NRESET
  Top 0.152: U13.16 33.42,28 33.42,28.5 33.4,28.53 33.4,29.75 32.77,30.38 31.38,30.38 31,30.75 31,31.38 U1.7
X_NSLEEP
  Top 0.152: 32.75,28.38 32.75,28 U13.17 32.8,29.45 32.35,29.95 31.05,29.95 30.25,30.75 30.25,31.38 U1.6
Y_DECAY
  Top 0.152: U14.19 48.95,29.05 48,30 47.85,30 47.08,30.75 47.08,31.38 U2.5
Y_MODE0
  Top 0.152: U14.24 45.7,31.38 U2.3
Y_MODE1
  Top 0.152: U14.25 45.08,28 45.08,31.38 U2.2
Y_MODE2
  Top 0.152: U14.26 44.45,28 44.45,31.38 U2.1
Y_NENABLE
  Top 0.152: U14.21 47.58,28 47.58,29.63 46.45,30.75 46.45,31.38 U2.4
Y_NRESET
  Top 0.152: U14.16 50.83,28 50.83,30.08 50.55,30.35 48.98,30.35 48.95,30.38 48.83,30.38 48.45,30.75 48.45,31.38 U2.7
Y_NSLEEP
  Top 0.152: U14.17 50.2,28 50.2,29.2 49.6,29.8 48.77,29.8 48.2,30.38 48.08,30.38 47.7,30.75 47.7,31.38 U2.6
Z_DECAY
  Top 0.152: U15.19 65.45,28.73 65.2,29 64.05,30.15 63.75,30.15 63.58,30.33 63.58,31.08 U3.5
Z_MODE0
  Top 0.152: U15.24 62.2,31.08 U3.3
Z_MODE1
  Top 0.152: U15.25 61.58,27.7 61.58,31.08 U3.2
Z_MODE2
  Top 0.152: U15.26 60.95,27.7 60.95,31.08 U3.1
Z_NENABLE
  Top 0.152: U15.21 64.08,27.7 64.08,28.33 62.85,29.55 62.85,31.14 U3.4
Z_NRESET
  Top 0.152: U15.16 67.33,27.7 67.33,29.23 66.55,30 65.4,30 64.95,30.45 64.95,31.08 U3.7
Z_NSLEEP
  Top 0.152: U15.17 66.7,27.7 66.7,29.25 66.3,29.65 65.05,29.65 64.2,30.5 64.2,31.08 U3.6

### Text on the board
tNames: Reach | Ext4 | Rev A0 | Ext3 | Ext5 | Thermistors | Ext5 | Power | Ext4 | Ext3 | Heaters | Steppers | Fans | Ext3 | Ext4 | Ext5 | D | E | F | 12..24V
tDocu: Fuse | 20A